# Altium schematic sheet DieuKhienThietBiWinForm.SchDoc
size B
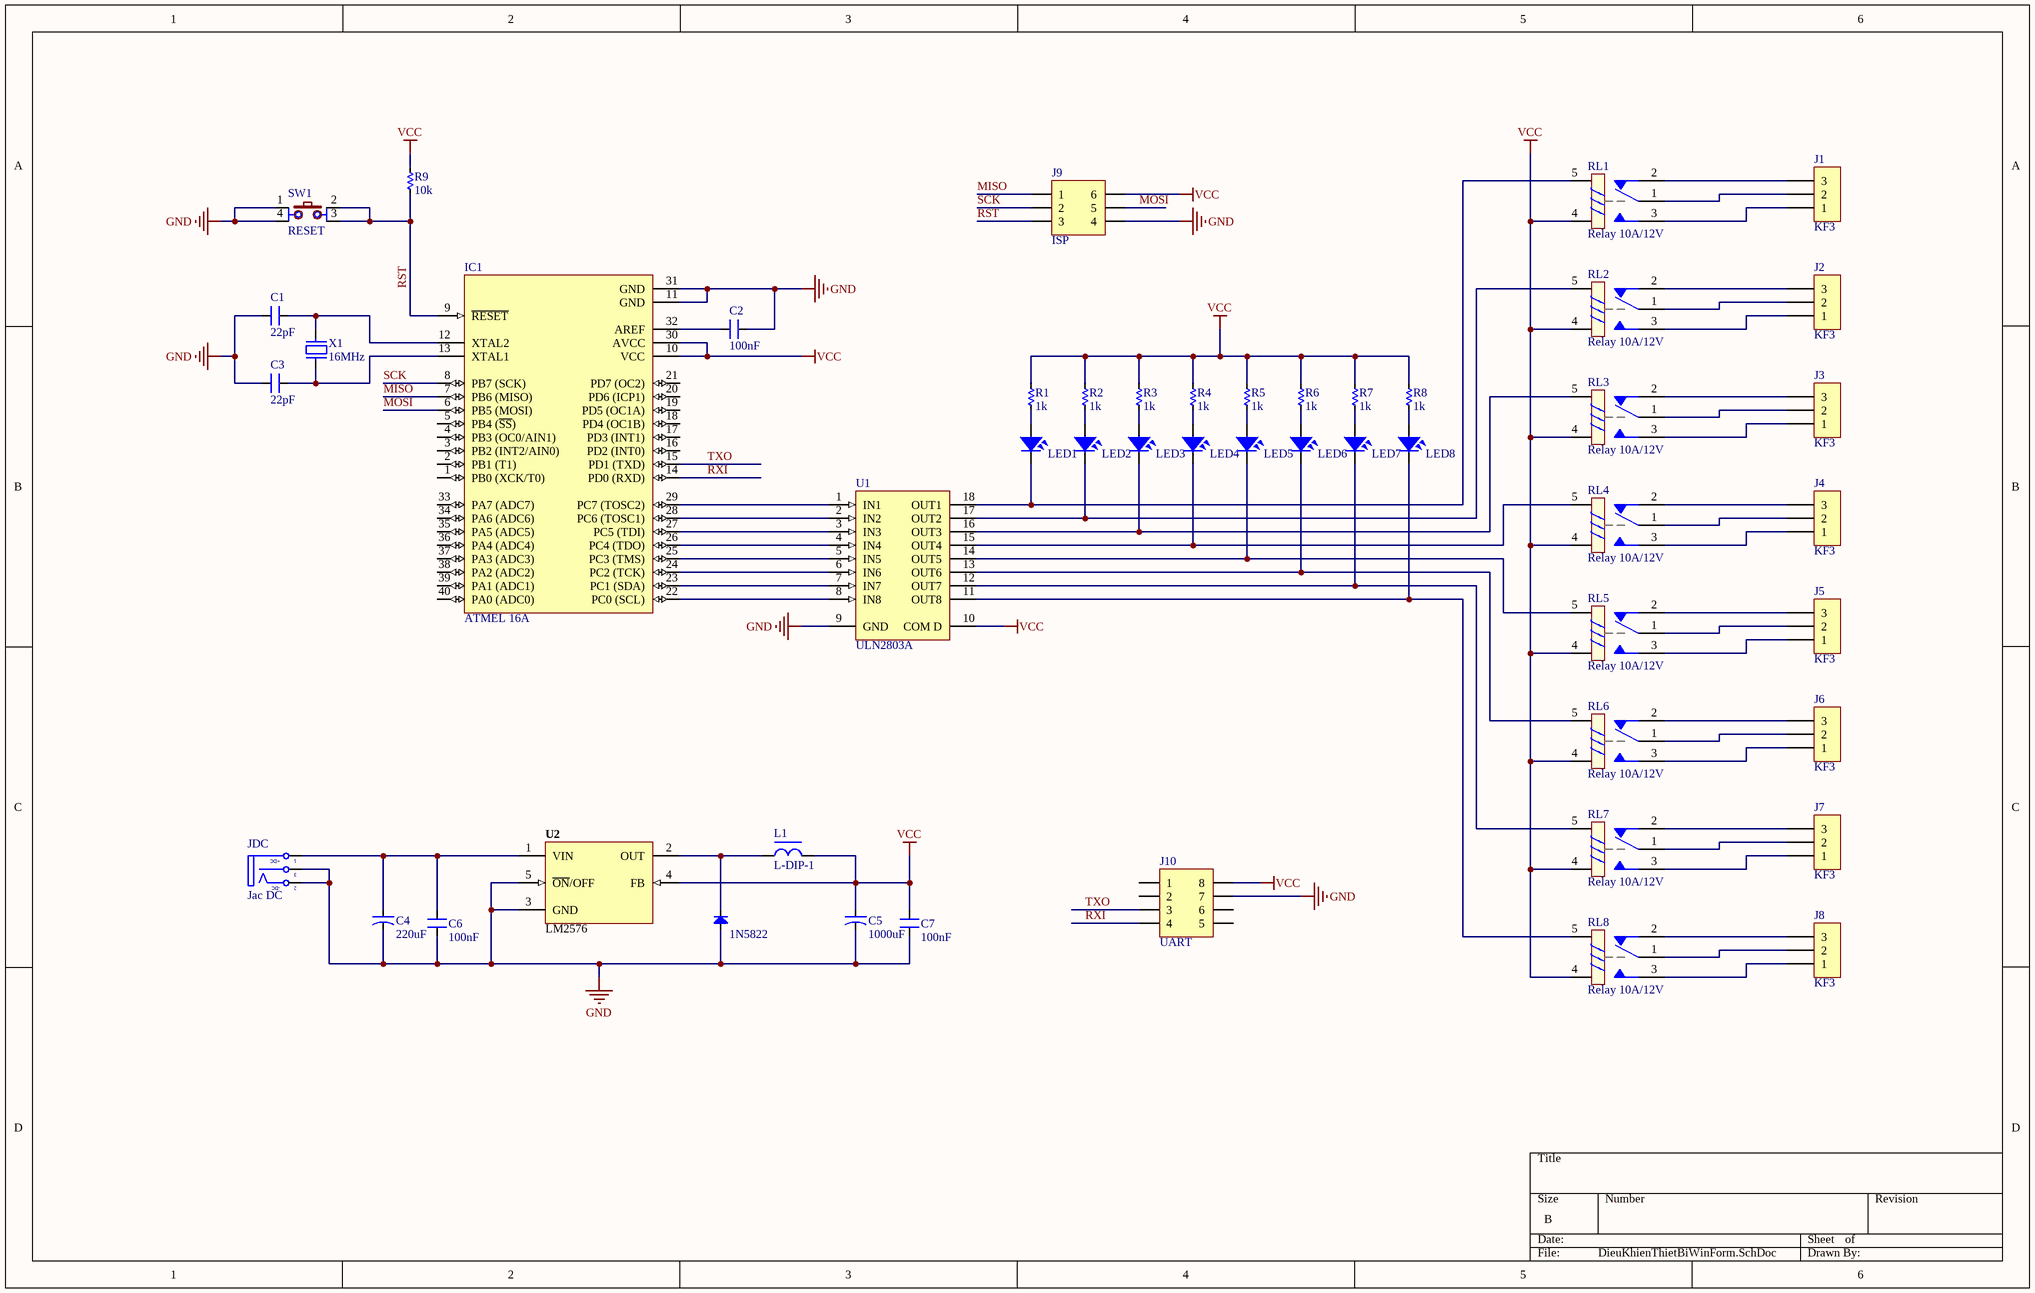
[diagram p0: DieuKhienThietBiWinForm.SchDoc]

## Parts
1N5822  Diode  [DIO-5A]  (value not drawn)
C1  22pF  [CN1.5]
C2  100nF  [CN1.5]
C3  22pF  [CN1.5]
C4  220uF  [CA-ALU-8]
C5  1000uF  [CA-ALU-10]
C6  100nF  [CN1.5]
C7  100nF  [CN1.5]
IC1  ATMEL 16A  [DIP40/W0.6]
J1  KF3  [KF3-5.08]
J2  KF3  [KF3-5.08]
J3  KF3  [KF3-5.08]
J4  KF3  [KF3-5.08]
J5  KF3  [KF3-5.08]
J6  KF3  [KF3-5.08]
J7  KF3  [KF3-5.08]
J8  KF3  [KF3-5.08]
J9  ISP  [JP3-D2T]
J10  UART  [JP4-D2T]
JDC  Jac DC  [DC0]
L1  L-DIP-1  [L-DIP-M-8]
LED1  LED  [LED-5-RED]  (value not drawn)
LED2  LED  [LED-5-RED]  (value not drawn)
LED3  LED  [LED-5-RED]  (value not drawn)
LED4  LED  [LED-5-RED]  (value not drawn)
LED5  LED  [LED-5-RED]  (value not drawn)
LED6  LED  [LED-5-RED]  (value not drawn)
LED7  LED  [LED-5-RED]  (value not drawn)
LED8  LED  [LED-5-RED]  (value not drawn)
R1  1k  [RES-1/2W]
R2  1k  [RES-1/2W]
R3  1k  [RES-1/2W]
R4  1k  [RES-1/2W]
R5  1k  [RES-1/2W]
R6  1k  [RES-1/2W]
R7  1k  [RES-1/2W]
R8  1k  [RES-1/2W]
R9  10k  [RES-1/2W]
RL1  Relay 10A/12V  [RELAY 5]
RL2  Relay 10A/12V  [RELAY 5]
RL3  Relay 10A/12V  [RELAY 5]
RL4  Relay 10A/12V  [RELAY 5]
RL5  Relay 10A/12V  [RELAY 5]
RL6  Relay 10A/12V  [RELAY 5]
RL7  Relay 10A/12V  [RELAY 5]
RL8  Relay 10A/12V  [RELAY 5]
SW1  RESET  [SW2-DIP]
U1  ULN2803A  [DIP18]
U2  LM2576  [DIP5]
X1  16MHz  [XT2]

## Nets
GND: 1N5822.1(A) C1.1 C2.2 C3.1 C4.2 C5.2 C6.1 C7.1 IC1.11(GND) IC1.31(GND) J9.4 J10.7 JDC.2(TN) JDC.3(S) SW1.1 SW1.4 U1.9(GND) U2.3(GND) U2.5(~{ON}/OFF)
VCC: C5.1 C7.2 IC1.10(VCC) IC1.30(AVCC) J9.6 J10.8 L1.2 R1.2 R2.2 R3.2 R4.2 R5.2 R6.2 R7.2 R8.2 R9.2 RL1.4 RL2.4 RL3.4 RL4.4 RL5.4 RL6.4 RL7.4 RL8.4 U1.10(COM_D) U2.4(FB)
MISO: IC1.7(PB6_(MISO)) J9.1
MOSI: IC1.6(PB5_(MOSI)) J9.5
RST: IC1.9(~{RESET}) J9.3 R9.1 SW1.2 SW1.3
RXI: IC1.14(PD0_(RXD)) J10.4
SCK: IC1.8(PB7_(SCK)) J9.2
TXO: IC1.15(PD1_(TXD)) J10.3
Net1N5822_2: 1N5822.2(K) L1.1 U2.2(OUT)
NetC1_2: C1.2 IC1.12(XTAL2) X1.1
NetC2_1: C2.1 IC1.32(AREF)
NetC3_2: C3.2 IC1.13(XTAL1) X1.2
NetC4_1: C4.1 C6.2 JDC.1(T) U2.1(VIN)
NetIC1_22: IC1.22(PC0_(SCL)) U1.8(IN8)
NetIC1_23: IC1.23(PC1_(SDA)) U1.7(IN7)
NetIC1_24: IC1.24(PC2_(TCK)) U1.6(IN6)
NetIC1_25: IC1.25(PC3_(TMS)) U1.5(IN5)
NetIC1_26: IC1.26(PC4_(TDO)) U1.4(IN4)
NetIC1_27: IC1.27(PC5_(TDI)) U1.3(IN3)
NetIC1_28: IC1.28(PC6_(TOSC1)) U1.2(IN2)
NetIC1_29: IC1.29(PC7_(TOSC2)) U1.1(IN1)
NetJ1_1: J1.1 RL1.3
NetJ1_2: J1.2 RL1.1
NetJ1_3: J1.3 RL1.2
NetJ2_1: J2.1 RL2.3
NetJ2_2: J2.2 RL2.1
NetJ2_3: J2.3 RL2.2
NetJ3_1: J3.1 RL3.3
NetJ3_2: J3.2 RL3.1
NetJ3_3: J3.3 RL3.2
NetJ4_1: J4.1 RL4.3
NetJ4_2: J4.2 RL4.1
NetJ4_3: J4.3 RL4.2
NetJ5_1: J5.1 RL5.3
NetJ5_2: J5.2 RL5.1
NetJ5_3: J5.3 RL5.2
NetJ6_1: J6.1 RL6.3
NetJ6_2: J6.2 RL6.1
NetJ6_3: J6.3 RL6.2
NetJ7_1: J7.1 RL7.3
NetJ7_2: J7.2 RL7.1
NetJ7_3: J7.3 RL7.2
NetJ8_1: J8.1 RL8.3
NetJ8_2: J8.2 RL8.1
NetJ8_3: J8.3 RL8.2
NetLED1_1: LED1.1 R1.1
NetLED1_2: LED1.2 RL1.5 U1.18(OUT1)
NetLED2_1: LED2.1 R2.1
NetLED2_2: LED2.2 RL2.5 U1.17(OUT2)
NetLED3_1: LED3.1 R3.1
NetLED3_2: LED3.2 RL3.5 U1.16(OUT3)
NetLED4_1: LED4.1 R4.1
NetLED4_2: LED4.2 RL4.5 U1.15(OUT4)
NetLED5_1: LED5.1 R5.1
NetLED5_2: LED5.2 RL5.5 U1.14(OUT5)
NetLED6_1: LED6.1 R6.1
NetLED6_2: LED6.2 RL6.5 U1.13(OUT6)
NetLED7_1: LED7.1 R7.1
NetLED7_2: LED7.2 RL7.5 U1.12(OUT7)
NetLED8_1: LED8.1 R8.1
NetLED8_2: LED8.2 RL8.5 U1.11(OUT8)

Not connected (* = marked no-connect by the designer): IC1 1(PB0_(XCK/T0)) 2(PB1_(T1)) 3(PB2_(INT2/AIN0)) 4(PB3_(OC0/AIN1)) 5(PB4_(~{SS})) 16(PD2_(INT0)) 17(PD3_(INT1)) 18(PD4_(OC1B)) 19(PD5_(OC1A)) 20(PD6_(ICP1)) 21(PD7_(OC2)) 33(PA7_(ADC7)) 34(PA6_(ADC6)) 35(PA5_(ADC5)) 36(PA4_(ADC4)) 37(PA3_(ADC3)) 38(PA2_(ADC2)) 39(PA1_(ADC1)) 40(PA0_(ADC0)); J10 1 2 5 6

## Notes on the sheet
- (in symbol DCIN) +DC; -DC

## Library data of the parts
1N5822 = Diode: Default Diode; Code - JEDEC: DO-214-AB; Value: 1N5007; Published: 8-Jun-2000; Revision: July-2002: Re-released for DXP Platform.; Publisher: Altium Limited
C1-C3 C6 C7 = CN: Value: 33pF
C4 C5 = CN-ALU-DIP: Capacitor (Semiconductor SIM Model); Value: 104; LatestRevisionDate: 17-Jul-2002; LatestRevisionNote: Re-released for DXP Platform.; PackageReference: C1206; Publisher: Altium Limited
IC1 = ATmega16A-PU: 8-Bit AVR Microcontroller with 16K Bytes of In-System Programmable Flash Memory; Value: Atmega 16L
J1-J8 = KF3: Manufacturer: Würth Elektronik eiSos GmbH; partNo: 691103110003; ComponentLink1 Description: Manufacturer; ComponentLink2 Description: Datasheet; NoPins: 3; Created Date: 29 October 2013; ComponentLink1URL: http://www.we-online.com; ComponentLink2URL: http://katalog.we-online.de/em/datasheet/6911031100xx.pdf; Created by: Karrer Zheng
J9 = JP3x2: WR-PHD 2.54 mm Dual Socket Header; Manufacturer: W¨¹rth Elektronik eiSos GmbH; partNo: 61300621821; ComponentLink1 Description: Manufacturer; ComponentLink2 Description: Datasheet; NoPins: 06; Created Date: 29 March 2013; ComponentLink1URL: http://www.we-online.com; ComponentLink2URL: http://katalog.we-online.de/em/datasheet/6130xx21821.pdf; Created by: Karrer Zheng
J10 = JP4x2: WR-PHD 2.54 mm Dual Socket Header; Manufacturer: W¨¹rth Elektronik eiSos GmbH; partNo: 61300821821; ComponentLink1 Description: Manufacturer; ComponentLink2 Description: Datasheet; NoPins: 08; Created Date: 29 March 2013; ComponentLink1URL: http://www.we-online.com; ComponentLink2URL: http://katalog.we-online.de/em/datasheet/6130xx21821.pdf; Created by: Karrer Zheng
JDC = DCIN: Jac DC input; Value: Jac DC
L1 = L-DIP-1: Inductor; Value: 150 mH
LED1-LED8 = LED: LED Single colour Green and Red; Value: LED 3 ly Single Colour
R1-R9 = Res: Manufacturer: Generic Components; Class: Passive; SubClass: R; Published: 08/06/2000; Publisher: Altium Hobart Technology Centre
RL1-RL8 = Relay 5: Relay SPDT,10A - 12VDC 5 Pin; Value: Relay SPDT, 10A, 12V
SW1 = SW4: Switch button 4 pin; Value: Button chip 4 pin
U1 = ULN2803A: High-Voltage, High-Current Darlington Array; Published: 13-Oct-2000; LatestRevisionDate: 06-Jun-2005; LatestRevisionNote: Stylized 3D Model Added.; DatasheetVersion: 1999; PackageVersion: 1999; PackageReference: A18; Publisher: Altium Limited; PackageDescription: DIP; 18 Leads; Row Spacing 7.62 mm; Pitch 2.54 mm; ComponentLink1Description: Manufacturer Link; ComponentLink1URL: http://www.allegromicro.com/
U2 = LM2576: Max Input Voltage: 12 V; Max Output Current: 3 (6.0 peak) A; Max Output Voltage: mV; Category: IC-Power; Min Input Voltage: mV; Min Output Voltage: mV; Mounting Technology: Surface Mount; Status: Unreleased; Supply Voltage: mV; Temperature Range: -40 to +125 degC
X1 = XT2: Crystal, 32.768 KHz, -40 to 85 degC, 3.2 x 1.5 x 0.9 mm SMD; Value: 4Mhz